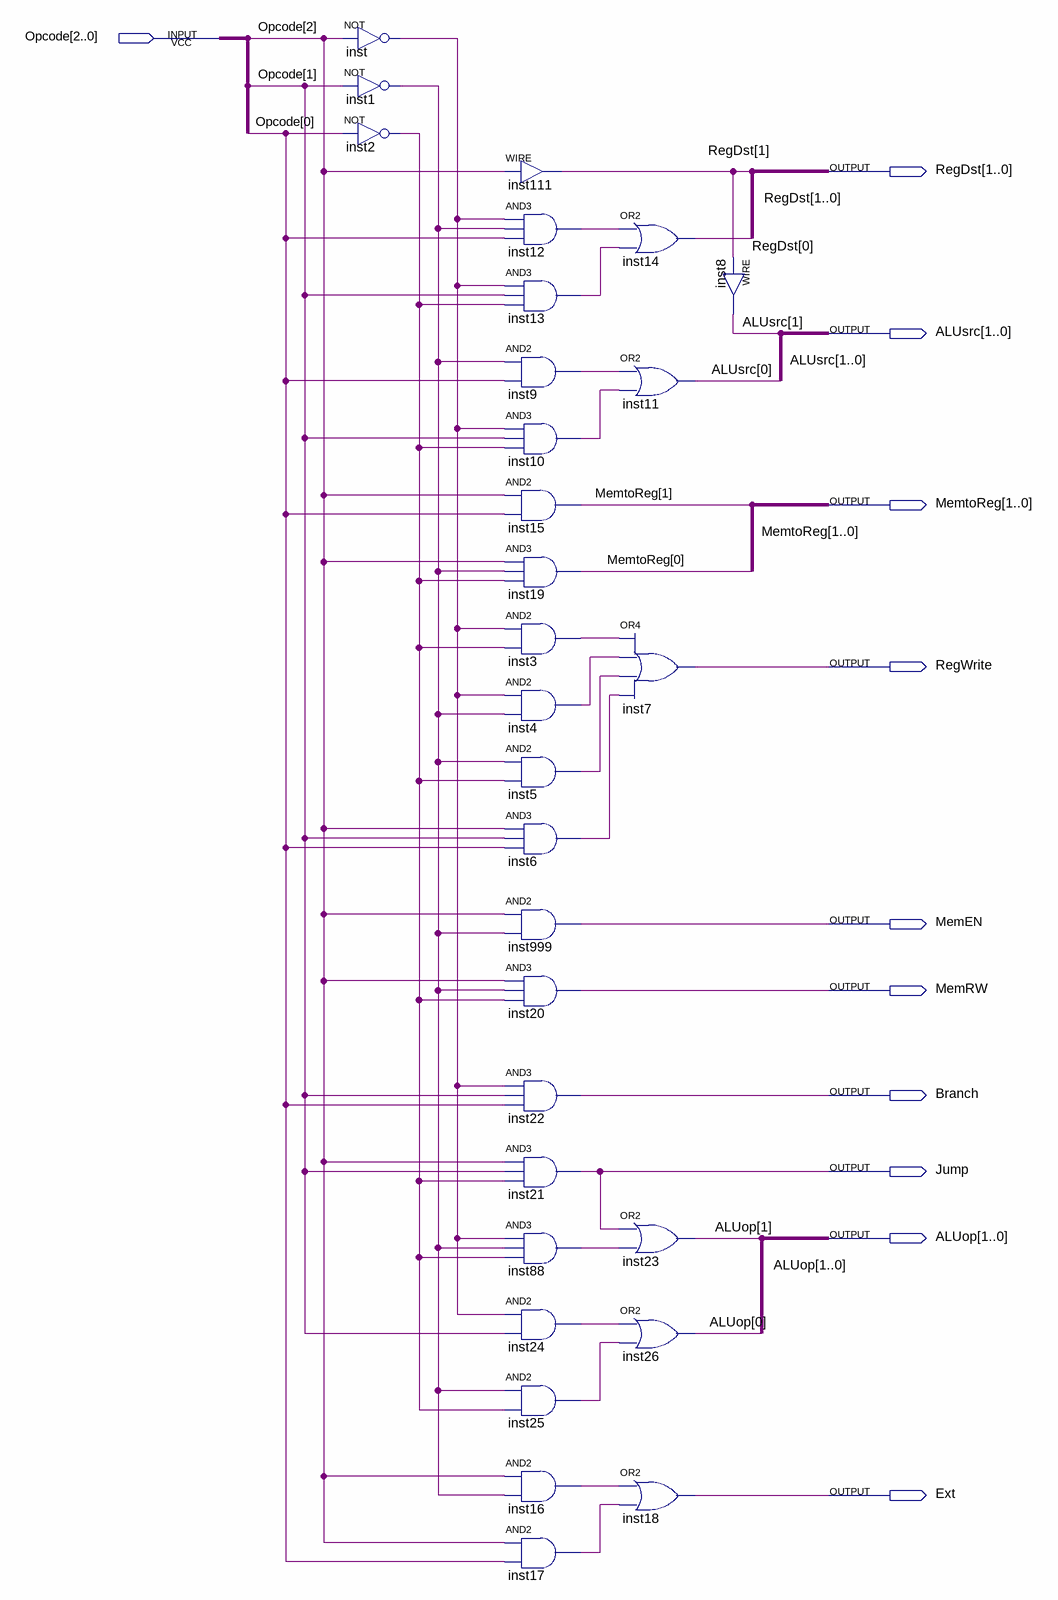
[diagram p0: schematic sheet]
// Quartus schematic ControlUnit.bdf as structural Verilog: 30 symbols, 11 pins
module ControlUnit (
  input  [2:0] Opcode,
  output [1:0] RegDst,
  output [1:0] ALUsrc,
  output [1:0] MemtoReg,
  output RegWrite,
  output MemEN,
  output MemRW,
  output Branch,
  output Jump,
  output [1:0] ALUop,
  output Ext
);

  wire inst1_out, inst2_out, inst3_out, inst4_out, inst5_out, inst6_out, inst9_out, inst10_out, inst12_out,
       inst13_out, inst16_out, inst17_out, inst24_out, inst25_out, inst88_out, inst_out;

  not inst (inst_out, Opcode[2]);
  not inst1 (inst1_out, Opcode[1]);
  not inst2 (inst2_out, Opcode[0]);
  assign RegDst[1] = Opcode[2];  // WIRE inst111
  and inst12 (inst12_out, inst_out, inst1_out, Opcode[0]);
  and inst13 (inst13_out, inst_out, Opcode[1], inst2_out);
  and inst9 (inst9_out, inst1_out, Opcode[0]);
  and inst10 (inst10_out, inst_out, Opcode[1], inst2_out);
  and inst15 (MemtoReg[1], Opcode[2], Opcode[0]);
  and inst19 (MemtoReg[0], Opcode[2], inst1_out, inst2_out);
  and inst3 (inst3_out, inst_out, inst2_out);
  and inst4 (inst4_out, inst_out, inst1_out);
  and inst5 (inst5_out, inst1_out, inst2_out);
  and inst6 (inst6_out, Opcode[2], Opcode[1], Opcode[0]);
  and inst999 (MemEN, Opcode[2], inst1_out);
  and inst20 (MemRW, Opcode[2], inst1_out, inst2_out);
  and inst22 (Branch, inst_out, Opcode[1], Opcode[0]);
  and inst21 (Jump, Opcode[2], Opcode[1], inst2_out);
  and inst88 (inst88_out, inst_out, inst1_out, inst2_out);
  and inst24 (inst24_out, inst_out, Opcode[1]);
  and inst25 (inst25_out, inst1_out, inst2_out);
  and inst16 (inst16_out, Opcode[2], inst1_out);
  and inst17 (inst17_out, Opcode[2], Opcode[0]);
  or inst14 (RegDst[0], inst12_out, inst13_out);
  or inst11 (ALUsrc[0], inst9_out, inst10_out);
  or inst7 (RegWrite, inst3_out, inst4_out, inst5_out, inst6_out);
  or inst23 (ALUop[1], Jump, inst88_out);
  or inst26 (ALUop[0], inst24_out, inst25_out);
  or inst18 (Ext, inst16_out, inst17_out);
  assign ALUsrc[1] = RegDst[1];  // WIRE inst8
endmodule
